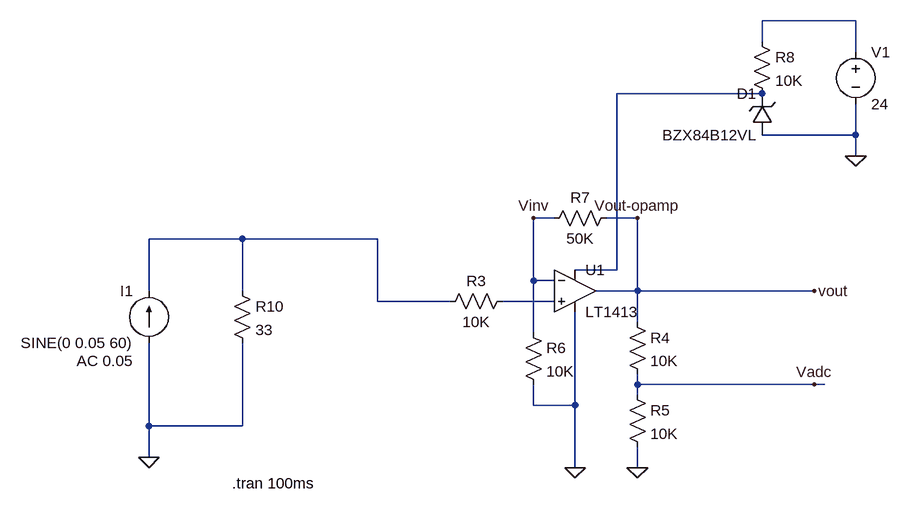
[diagram p0: schematic current_sense_amp.asc]
current_sense_amp.asc, the LTspice schematic file:
Version 4
SHEET 1 1316 680
WIRE 1056 -272 912 -272
WIRE 912 -240 912 -272
WIRE 1056 -224 1056 -272
WIRE 912 -160 688 -160
WIRE 1056 -96 1056 -144
WIRE 1056 -96 912 -96
WIRE 1056 -64 1056 -96
WIRE 592 32 560 32
WIRE 720 32 672 32
WIRE 112 64 -32 64
WIRE 320 64 112 64
WIRE 688 112 688 -160
WIRE 688 112 624 112
WIRE 560 128 560 32
WIRE 592 128 560 128
WIRE -32 144 -32 64
WIRE 112 144 112 64
WIRE 720 144 720 32
WIRE 720 144 656 144
WIRE 992 144 720 144
WIRE 320 160 320 64
WIRE 432 160 320 160
WIRE 592 160 512 160
WIRE 720 192 720 144
WIRE 560 208 560 128
WIRE 720 288 720 272
WIRE 992 288 720 288
WIRE 1008 288 992 288
WIRE 720 304 720 288
WIRE 560 320 560 288
WIRE 624 320 624 176
WIRE 624 320 560 320
WIRE -32 352 -32 224
WIRE 112 352 112 224
WIRE 112 352 -32 352
WIRE -32 400 -32 352
WIRE 624 416 624 320
WIRE 720 416 720 384
FLAG 1056 -64 0
FLAG 720 416 0
FLAG 624 416 0
FLAG 560 32 Vinv
FLAG 720 32 Vout-opamp
FLAG 992 288 Vadc
FLAG -32 400 0
FLAG 992 144 vout
SYMBOL voltage 1056 -240 R0
WINDOW 123 0 0 Left 0
WINDOW 39 0 0 Left 0
SYMATTR InstName V1
SYMATTR Value 24
SYMBOL res 528 144 R90
WINDOW 0 0 56 VBottom 2
WINDOW 3 32 56 VTop 2
SYMATTR InstName R3
SYMATTR Value 10K
SYMBOL res 544 192 R0
SYMATTR InstName R6
SYMATTR Value 10K
SYMBOL res 688 16 R90
WINDOW 0 0 56 VBottom 2
WINDOW 3 32 56 VTop 2
SYMATTR InstName R7
SYMATTR Value 50K
SYMBOL Opamps\\LT1413 624 80 R0
SYMATTR InstName U1
SYMBOL res 704 176 R0
SYMATTR InstName R4
SYMATTR Value 10K
SYMBOL res 704 288 R0
SYMATTR InstName R5
SYMATTR Value 10K
SYMBOL res 896 -256 R0
SYMATTR InstName R8
SYMATTR Value 10K
SYMBOL zener 928 -96 R180
WINDOW 0 24 64 Left 2
WINDOW 3 24 0 Left 2
SYMATTR InstName D1
SYMATTR Value BZX84B12VL
SYMBOL res 96 128 R0
SYMATTR InstName R10
SYMATTR Value 33
SYMBOL current -32 224 R180
WINDOW 0 24 80 Left 2
WINDOW 3 24 0 Left 2
WINDOW 123 24 -28 Left 2
WINDOW 39 0 0 Left 0
SYMATTR InstName I1
SYMATTR Value SINE(0 0.05 60)
SYMATTR Value2 AC 0.05
TEXT 96 440 Left 2 !.tran 100ms

The netlist it stands for:
* current_sense_amp.asc
V1 N001 0 24
R3 N004 N003 10K
R6 Vinv 0 10K
R7 vout Vinv 50K
XU1 N004 Vinv N002 0 vout LT1413  ; pins In+ In- V+ V- OUT
R4 vout Vadc 10K
R5 Vadc 0 10K
R8 N001 N002 10K
D1 0 N002 BZX84B12VL
R10 N003 0 33
I1 0 N003 SINE(0 0.05 60) AC 0.05
.model D D
.lib standard.dio
.tran 100ms
.lib LTC.lib
.backanno
.end